# EAGLE design power_distributor (EAGLE 6.5.0)
CNAME: Kbots - Power Distributor; CREVISION: 1.0; DESIGNER: X. Lagorce
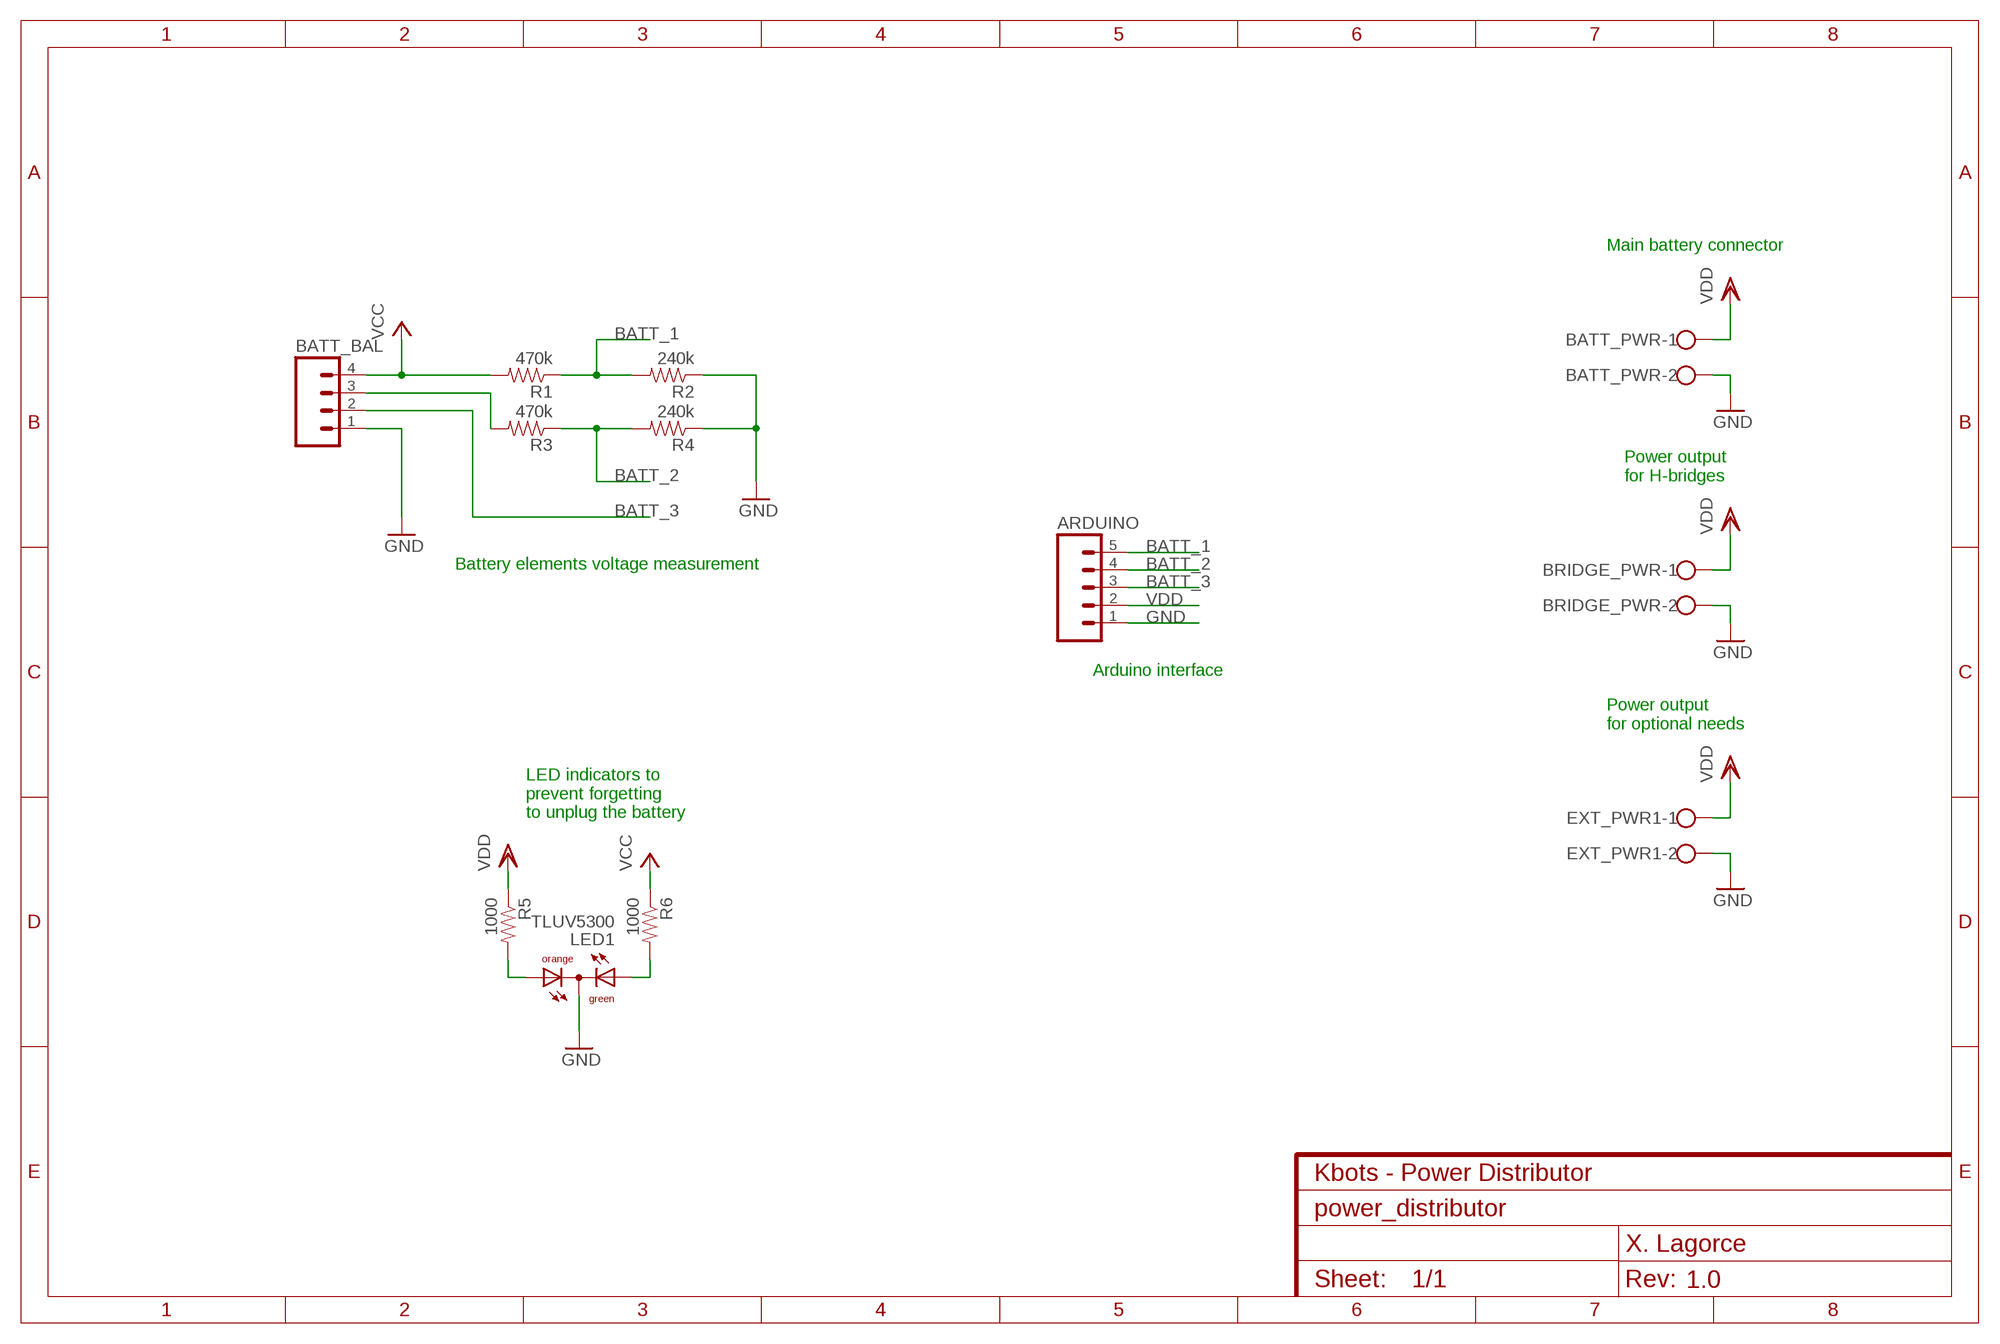
[diagram p0: schematic, sheet 1]

## Parts
ARDUINO  M05PTH  [1X05]
BATT_BAL  M04POLAR  [MOLEX-1X4]
BATT_PWR  W237-102  [W237-102]
BRIDGE_PWR  W237-102  [W237-102]
EXT_PWR1  W237-102  [W237-102]
LED1  TLUV5300  [TLUV5300]
R1  470k  RESISTOR1206  [1206]
R2  240k  RESISTOR1206  [1206]
R3  470k  RESISTOR1206  [1206]
R4  240k  RESISTOR1206  [1206]
R5  1000  RESISTOR1206  [1206]
R6  1000  RESISTOR1206  [1206]

## Nets
BATT_1: ARDUINO.5 R1.1 R2.2
BATT_2: ARDUINO.4 R3.1 R4.2
BATT_3: ARDUINO.3 BATT_BAL.2
GND: ARDUINO.1 BATT_BAL.1 BATT_PWR.2 BRIDGE_PWR.2 EXT_PWR1.2 LED1.CC R2.1 R4.1
N$1: LED1.AO R5.2
N$2: BATT_BAL.3 R3.2
N$3: LED1.AG R6.2
VCC: BATT_BAL.4 R1.2 R6.1
VDD: ARDUINO.2 BATT_PWR.1 BRIDGE_PWR.1 EXT_PWR1.1 R5.1

## Notes on the sheet
- Main battery connector
- Power output
  for H-bridges
- Battery elements voltage measurement
- Arduino interface
- Power output
  for optional needs
- LED indicators to
  prevent forgetting
  to unplug the battery

## Library data of the parts
ARDUINO = SparkFun-Connectors:M05: Header 5 Standard 5-pin 0.1" header. Use with straight break away headers (SKU : PRT-00116), right angle break away headers (PRT-00553), swiss pins (PRT-00743), machine pins (PRT-00117), and female headers (PRT-00115). Molex polarized connector foot print use with SKU : PRT-08230 with associated crimp pins and housings.
BATT_BAL = SparkFun-Connectors:M04: Header 4 Standard 4-pin 0.1" header. Use with straight break away headers (SKU : PRT-00116), right angle break away headers (PRT-00553), swiss pins (PRT-00743), machine pins (PRT-00117), and female headers (PRT-00115). Molex polarized connector foot print use with SKU : PRT-08231 with associated crimp pins and housings. 1MM SMD Version SKU: PRT-10208
BATT_PWR BRIDGE_PWR EXT_PWR1 = con-wago-500:W237-102: WAGO SCREW CLAMP; MPN: 237-102; OC_FARNELL: unknown; OC_NEWARK: 70K9898
LED1 = led:TLUV5300: Bicolor LED 5 mm Untinted Diffused Package Source: www.vishay.com .. Bi-Color LED Vashay TLUV5300.pdf
R1-R6 = SparkFun-Passives:RESISTOR: Resistor Basic schematic elements and footprints for 0603, 1206, and PTH resistors.

## Board
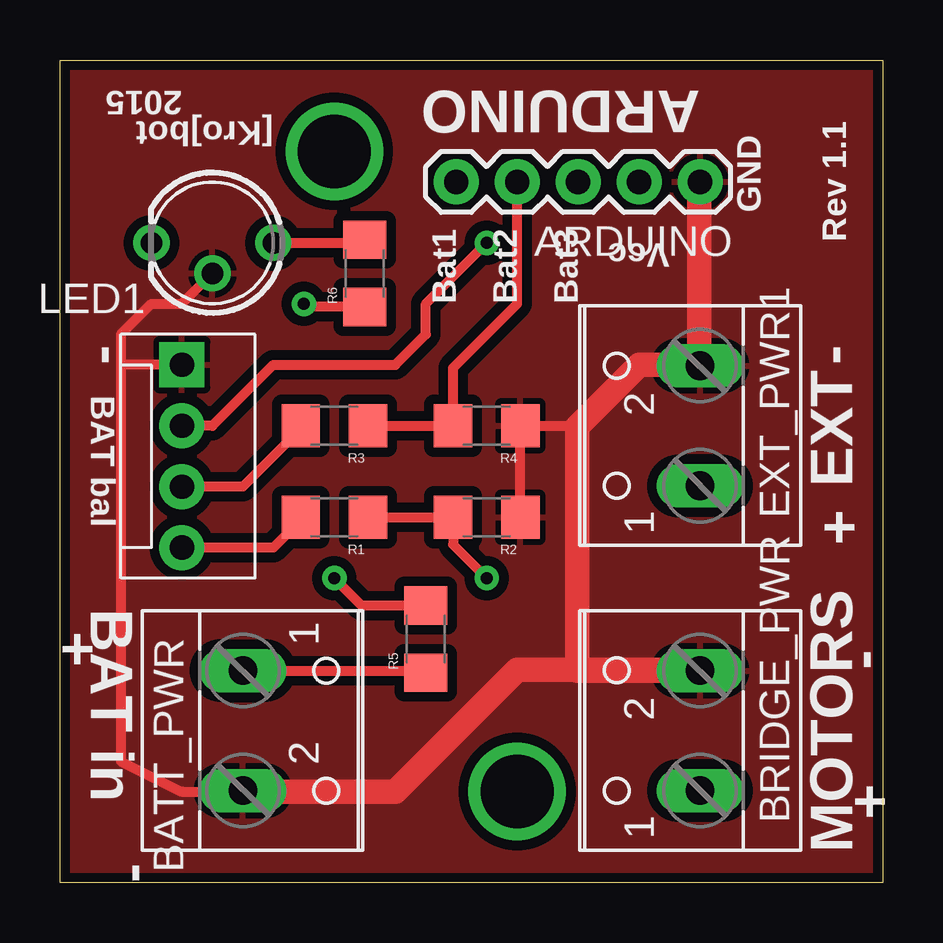
[diagram p1: board, top side]
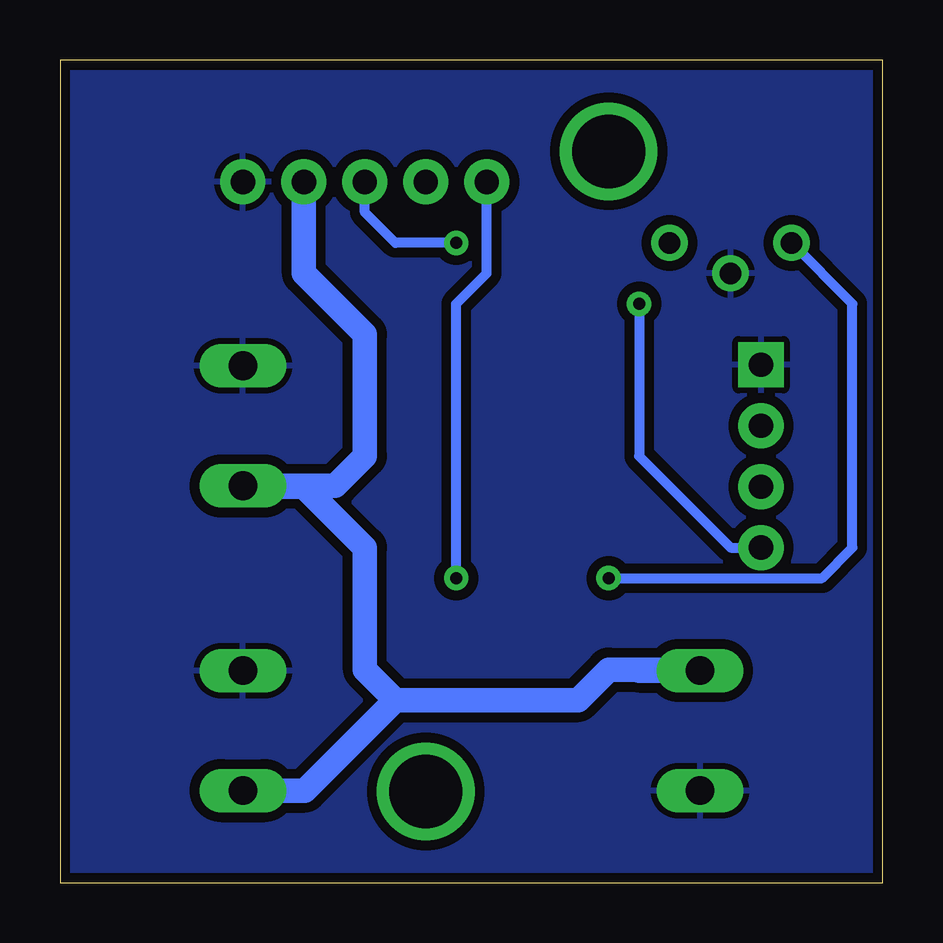
[diagram p2: board, bottom side, seen from below]

Size 34.29 x 34.29 mm. Coordinates in mm from the lower left corner, seen from the top.
Outline: 0,0 0,34.29 34.29,34.29 34.29,0 0,0
Copper layers (1*16): Top 0.035mm / dielectric 1.5mm / Bottom 0.035mm
Design rules "electrodragon": minimum track width 6mil, minimum drill 12mil, track to track 6mil, track to pad 6mil, pad to pad 6mil, via to via 6mil, smd to smd 6mil, copper to edge 8mil, drill to drill 6mil, minimum pad ring 12mil, minimum via ring 10mil, stop-mask expansion 4mil, vias tented up to drill 0mil, thermal gap 10mil

### Footprints (pad centres in the part's own frame; a part is rotated, then mirrored left to right if it is on the bottom)
1X05 = drill 1.016 pad 1.88: 1 0,0; 2 2.54,0; 3 5.08,0; 4 7.62,0; 5 10.16,0
MOLEX-1X4 = drill 1.016 pad 1.88 square: 1 0,0 | drill 1.016 pad 1.88: 2 2.54,0; 3 5.08,0; 4 7.62,0
W237-102 = drill 1.194 long: 1 -2.5,-1.27; 2 2.5,-1.27
TLUV5300 = drill 0.9 pad 1.5: AG 2.54,0; AO -2.54,0; CC 0,-1.27
1206 = smd 1.6 x 1.8: 1 -1.4,0; 2 1.4,0

### Placement (x,y rotation side)
ARDUINO  26.67,29.21 180 top
BATT_BAL  5.08,21.59 270 top
BATT_PWR  8.89,6.35 270 top
BRIDGE_PWR  25.4,6.35 90 top
EXT_PWR1  25.4,19.05 90 top
LED1  6.35,26.67 0 top
R1  11.43,15.24 180 top
R2  17.78,15.24 180 top
R3  11.43,19.05 180 top
R4  17.78,19.05 180 top
R5  15.24,10.16 90 top
R6  12.7,25.4 90 top

### Tracks (layer width: path | path; a pad name or v marks a point on that pad's centre or on a via)
BATT_1  (via drill 0.51)
  Top 0.406: R1.1 R2.2 16.38,14.1 v17.78,12.7
  Bottom 0.406: v17.78,12.7 17.78,24.13 16.51,25.4 ARDUINO.5
BATT_2
  Top 0.406: R3.1 R4.2 16.38,21.46 19.05,24.13 ARDUINO.4
BATT_3  (via drill 0.51)
  Top 0.406: v17.78,26.67 15.24,24.13 15.24,22.86 13.97,21.59 8.89,21.59 6.35,19.05 BATT_BAL.2
  Bottom 0.406: v17.78,26.67 20.32,26.67 21.59,27.94 ARDUINO.3
GND
  Top 0.406: R2.1 R4.1 21.59,19.05 | 2.54,21.59 2.54,22.86 3.81,24.13 5.08,24.13 LED1.CC | 2.54,21.59 2.54,5.08 5.08,3.81 7.58,3.81 BATT_PWR.2 | BATT_BAL.1 2.54,21.59
  Top 1.016: BATT_PWR.2 7.66,3.81 13.97,3.81 19.05,8.89 26.63,8.89 BRIDGE_PWR.2 21.55,8.85 21.55,19.01 21.59,19.05 24.13,21.59 26.63,21.59 | 26.63,21.59 EXT_PWR1.2 | 26.63,21.59 26.63,29.17 ARDUINO.1
  pour Top (isolate 0.406): 0,0 0,34.29 34.29,34.29 34.29,0
  pour Bottom (isolate 0.406): 0,0 0,34.29 34.29,34.29 34.29,0
N$1  (via drill 0.51)
  Top 0.406: R5.2 12.57,11.56 v11.43,12.7
  Bottom 0.406: v11.43,12.7 2.54,12.7 1.27,13.97 1.27,24.13 LED1.AO
N$2
  Top 0.406: R3.2 10.03,18.92 7.62,16.51 BATT_BAL.3
N$3
  Top 0.406: LED1.AG 12.57,26.67 R6.2
N$6  (via drill 3.05)
  other vias: 19.05,3.81
N$7  (via drill 3.05)
  other vias: 11.43,30.48
VCC  (via drill 0.51)
  Top 0.406: R1.2 9.74,15.53 9.74,14.82 8.89,13.97 BATT_BAL.4 | R6.1 10.29,24 v10.16,24.13
  Bottom 0.406: v10.16,24.13 10.16,17.78 6.35,13.97 BATT_BAL.4
VDD
  Top 0.406: BATT_PWR.1 15.15,8.85 R5.1
  Bottom 1.016: 10.16,8.85 BATT_PWR.1 7.66,8.89 11.43,8.89 12.7,7.62 20.32,7.62 | ARDUINO.2 24.13,25.4 21.59,22.86 21.59,17.78 22.82,16.55 EXT_PWR1.1 26.63,16.51 24.13,16.51 21.59,13.97 21.59,8.89 20.32,7.62 | BRIDGE_PWR.1 24.09,3.85 20.32,7.62

### Text on the board
tPlace: 2015 | ARDUINO | [Kro]bot | Rev 1.1 | GND | Vcc | Bat1 | Bat2 | Bat3 | - | - | BAT bal | EXT | + | BAT in | + | - | + | MOTORS | -